# EAGLE board Papilio_DUO (EAGLE 6.6.0)
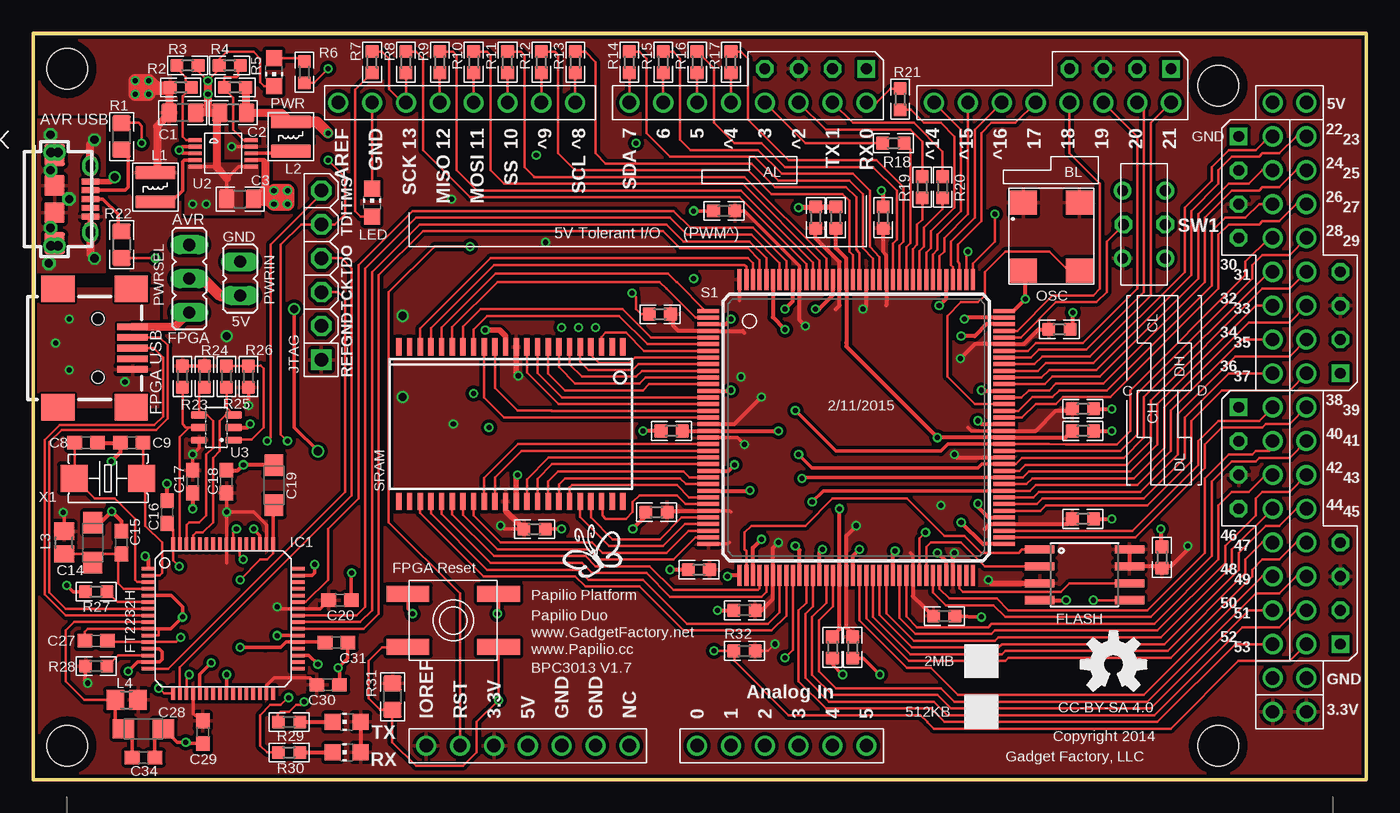
[diagram p5: board, top side]
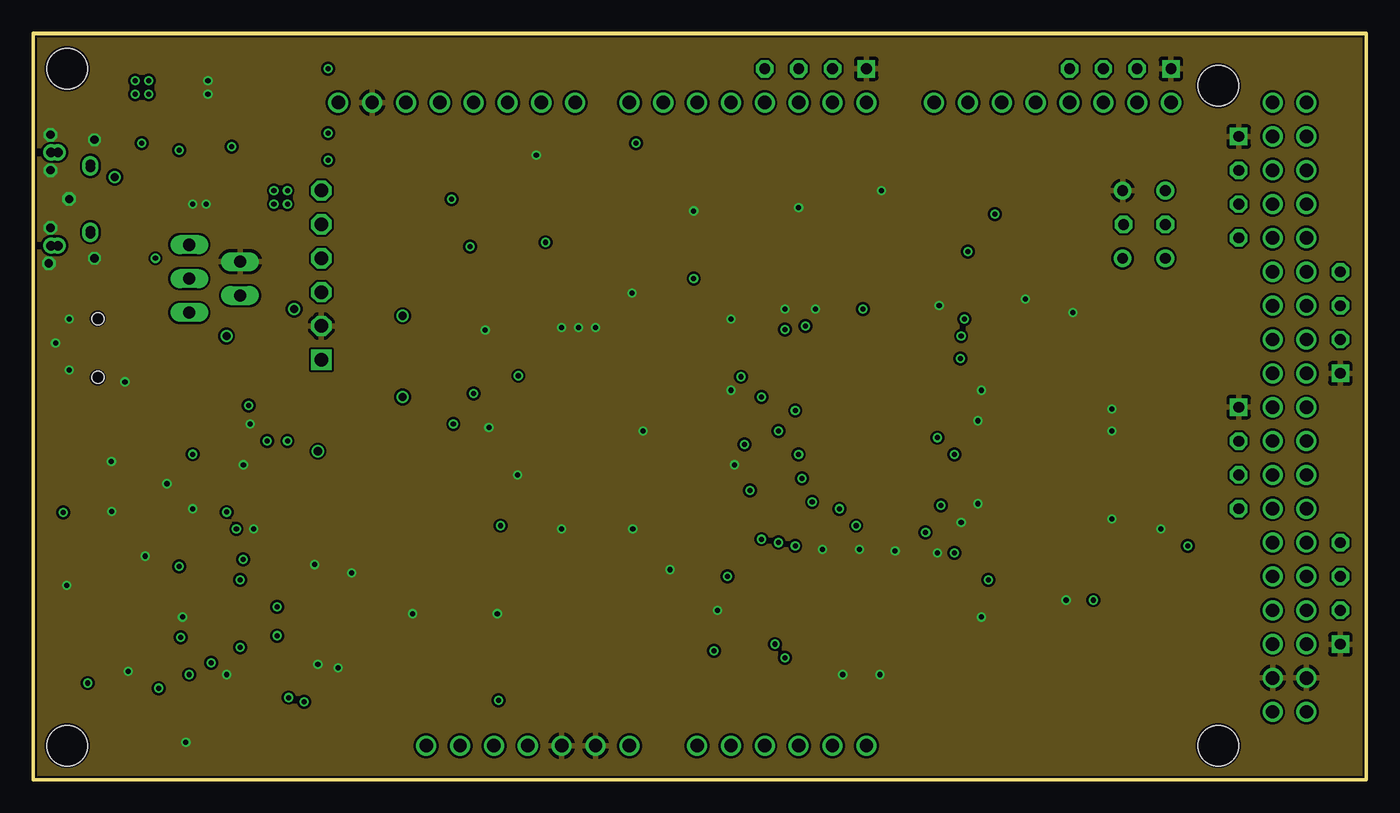
[diagram p6: board, inner layer Route2]
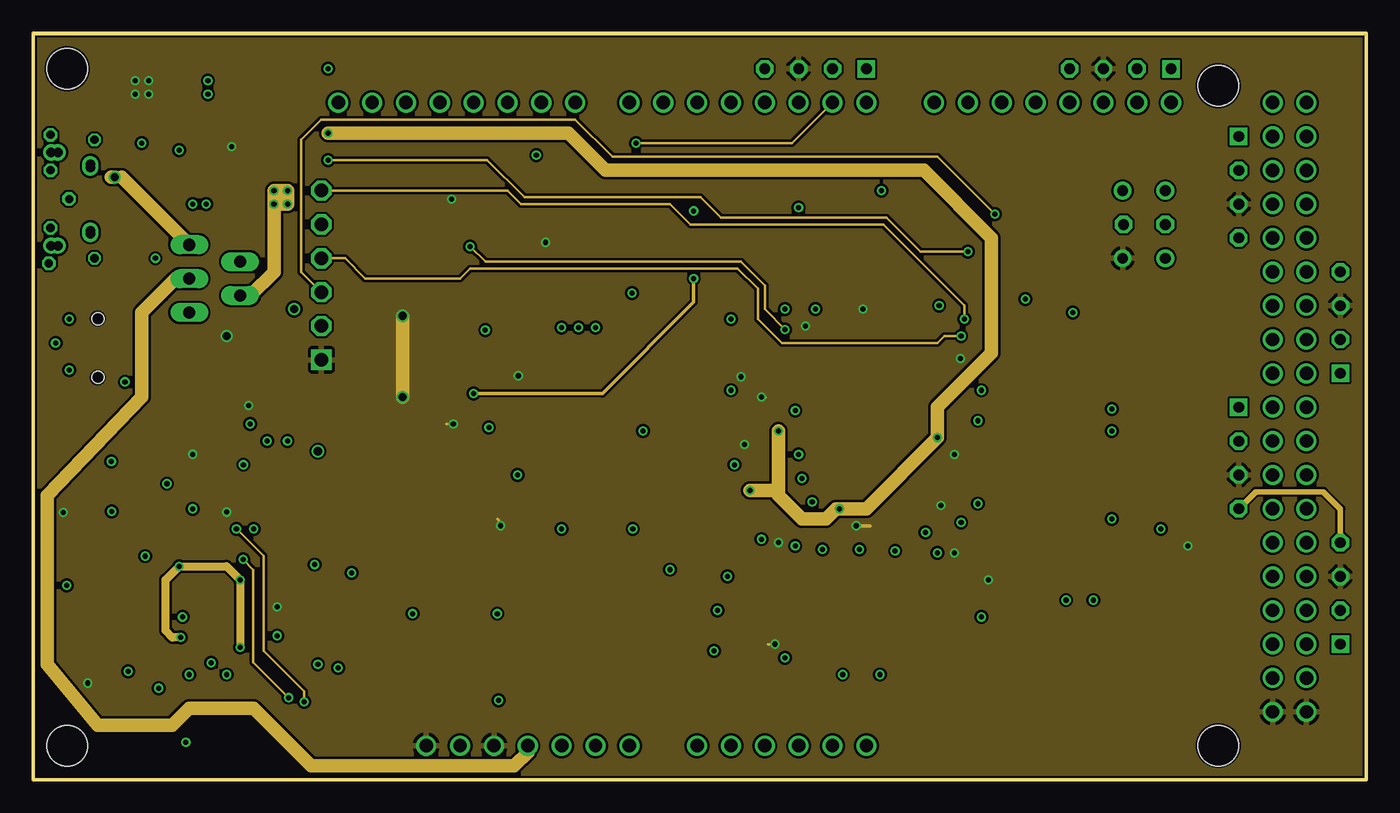
[diagram p7: board, inner layer Route3]
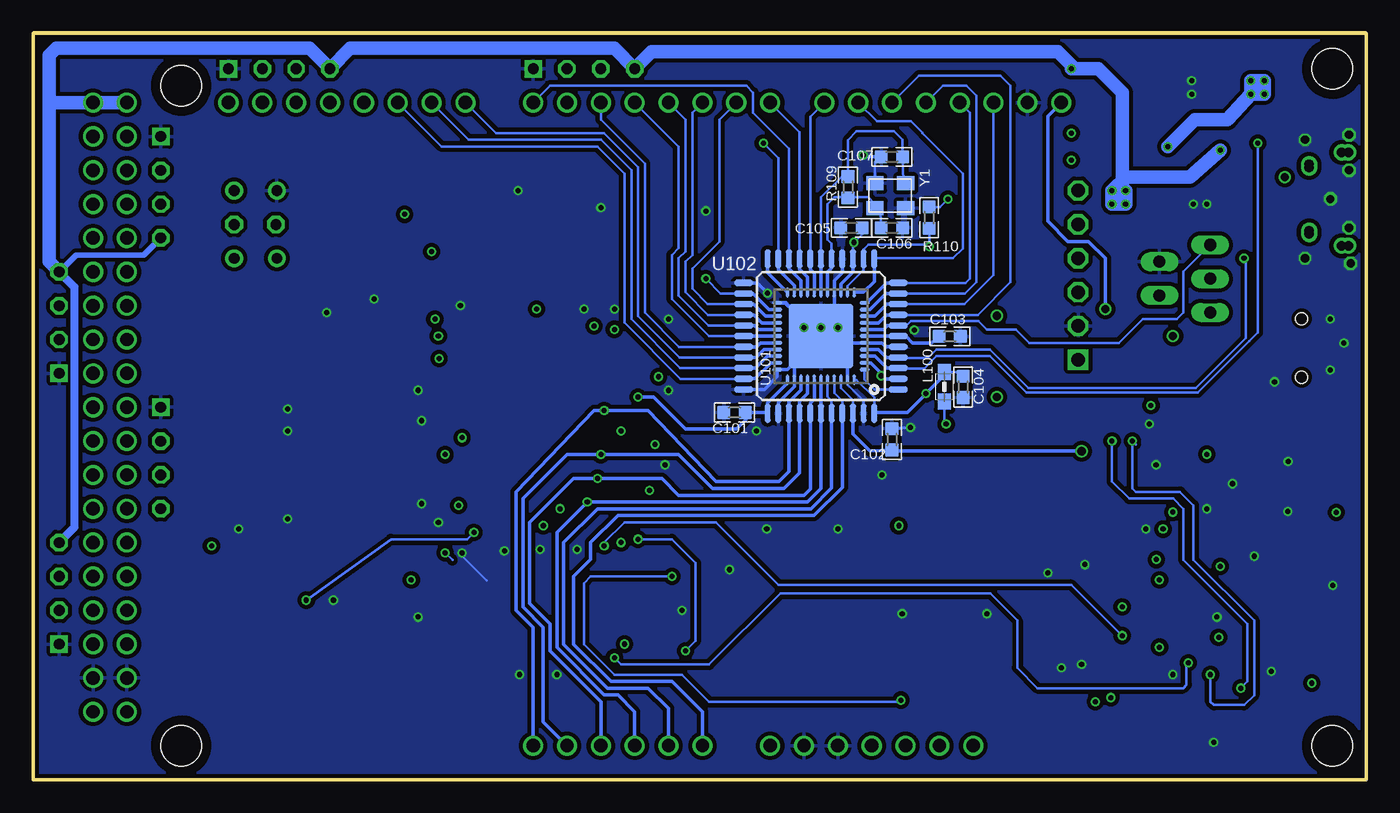
[diagram p8: board, bottom side, seen from below]

Size 100 x 56 mm. Coordinates in mm from the lower left corner, seen from the top.
Outline: 0,56 100,56 100,0 0,0 0,56
Outline: 0,56 56,56
Copper layers (1*2+3*16): Top 0.035mm / dielectric 1.5mm / Route2 0.035mm / dielectric 0.15mm / Route3 0.035mm / dielectric 0.2mm / Bottom 0.035mm
Design rules "hackvana *": minimum track width 6mil, minimum drill 0.3mm, track to track 6mil, track to pad 6mil, pad to pad 6mil, via to via 6mil, smd to smd 0mil, copper to edge 6mil, drill to drill 6mil, minimum pad ring 10mil, minimum via ring 6mil, stop-mask expansion 2mil, vias tented up to drill 100mil, thermal gap 10mil
Net classes: 0 default: width 0.178 mm, drill 0.381 mm, clearance 0.178 mm; 1 Power: width 0.254 mm, drill 0.381 mm, clearance 0.178 mm; 2 gnd: width 0.254 mm, drill 0.61 mm, clearance 0.254 mm; 3 usbvcc: width 0.254 mm, drill 0.61 mm, clearance 0.254 mm; 4 aref: width 0.254 mm, drill 0.61 mm, clearance 0.254 mm

## Footprints (pad centres in the part's own frame; a part is rotated, then mirrored left to right if it is on the bottom)
CON2_USB_MICRO_B_AT = drill 0.7 pad 0.813: K -3.505,0.254; L -3.505,-0.254; M 3.505,0.254; N 3.505,-0.254; O 2.616,2.692; P 2.362,2.692; Q -2.362,2.692; R -2.616,2.692 | smd 0.406 x 1.346: P1 -1.321,2.692; P2 -0.66,2.692; P3 0,2.692; P4 0.66,2.692; P5 1.321,2.692 | smd 1.651 x 1.549: S1 -3.302,0; S2 3.302,0 | smd 1.524 x 1.016: S3 -2.489,2.692; S4 2.489,2.692 | smd 1.524 x 1.524: S5 -1.016,0; S6 1.016,0
0805 = smd 1.2 x 1.4: 1 -1,0; 2 1,0
0603 = smd 1 x 1: 1 -0.8,0; 2 0.8,0
C603 = smd 1.1 x 1: 1 -0.85,0; 2 0.85,0
SMC_A = smd 1.6 x 1.4: + -1.5,0; - 1.5,0
SO08-EIAJ = smd 0.61 x 2.21: 1 -1.905,-3.378; 2 -0.635,-3.378; 3 0.635,-3.378; 4 1.905,-3.378; 5 1.905,3.353; 6 0.635,3.353; 7 -0.635,3.353; 8 -1.905,3.353
CONN_USB_MINI-B = smd 2 x 2.5: BODY@1 -4.45,2.5; BODY@2 4.45,2.5; BODY@3 4.45,-3; BODY@4 -4.45,-3 | smd 0.5 x 2.3: D+ 0,2.6; D- -0.8,2.6; GND 1.6,2.6; ID 0.8,2.6; VUSB -1.6,2.6 | hole 0.9: -2.2,0; 2.2,0
LQFP64 = smd 1 x 0.27: 1 -5.6,3.75; 2 -5.6,3.25; 3 -5.6,2.75; 4 -5.6,2.25; 5 -5.6,1.75; 6 -5.6,1.25; 7 -5.6,0.75; 8 -5.6,0.25; 9 -5.6,-0.25; 10 -5.6,-0.75; 11 -5.6,-1.25; 12 -5.6,-1.75; 13 -5.6,-2.25; 14 -5.6,-2.75; 15 -5.6,-3.25; 16 -5.6,-3.75; 33 5.6,-3.75; 34 5.6,-3.25; 35 5.6,-2.75; 36 5.6,-2.25; 37 5.6,-1.75; 38 5.6,-1.25; 39 5.6,-0.75; 40 5.6,-0.25; 41 5.6,0.25; 42 5.6,0.75; 43 5.6,1.25; 44 5.6,1.75; 45 5.6,2.25; 46 5.6,2.75; 47 5.6,3.25; 48 5.6,3.75 | smd 0.27 x 1: 17 -3.75,-5.6; 18 -3.25,-5.6; 19 -2.75,-5.6; 20 -2.25,-5.6; 21 -1.75,-5.6; 22 -1.25,-5.6; 23 -0.75,-5.6; 24 -0.25,-5.6; 25 0.25,-5.6; 26 0.75,-5.6; 27 1.25,-5.6; 28 1.75,-5.6; 29 2.25,-5.6; 30 2.75,-5.6; 31 3.25,-5.6; 32 3.75,-5.6; 49 3.75,5.6; 50 3.25,5.6; 51 2.75,5.6; 52 2.25,5.6; 53 1.75,5.6; 54 1.25,5.6; 55 0.75,5.6; 56 0.25,5.6; 57 -0.25,5.6; 58 -0.75,5.6; 59 -1.25,5.6; 60 -1.75,5.6; 61 -2.25,5.6; 62 -2.75,5.6; 63 -3.25,5.6; 64 -3.75,5.6
VLS3015 = smd 3 x 1: 1 0,1.1; 2 0,-1.1
FB603 = smd 1.3 x 1.5: 1 -0.85,0; 2 0.85,0
0805' = smd 1.2 x 1: 1 -1.1,0; 2 1.1,0
CHIP-LED0805 = smd 1.2 x 1.2: A 0,-1.05; C 0,1.05
OSC1 = smd 1.8 x 2: 1@1 0,0; 2@2 5.08,0; 3@3 5.08,4.2; 4@4 0,4.2
JP1 = drill 0.914 long: 1 0,-1.27; 2 0,1.27
JP2 = drill 0.914 long: 1 -2.54,0; 2 0,0; 3 2.54,0
TQ144 = smd 1.6 x 0.3: 1 -11.1,8.75; 2 -11.1,8.25; 3 -11.1,7.75; 4 -11.1,7.25; 5 -11.1,6.75; 6 -11.1,6.25; 7 -11.1,5.75; 8 -11.1,5.25; 9 -11.1,4.75; 10 -11.1,4.25; 11 -11.1,3.75; 12 -11.1,3.25; 13 -11.1,2.75; 14 -11.1,2.25; 15 -11.1,1.75; 16 -11.1,1.25; 17 -11.1,0.75; 18 -11.1,0.25; 19 -11.1,-0.25; 20 -11.1,-0.75; 21 -11.1,-1.25; 22 -11.1,-1.75; 23 -11.1,-2.25; 24 -11.1,-2.75; 25 -11.1,-3.25; 26 -11.1,-3.75; 27 -11.1,-4.25; 28 -11.1,-4.75; 29 -11.1,-5.25; 30 -11.1,-5.75; 31 -11.1,-6.25; 32 -11.1,-6.75; 33 -11.1,-7.25; 34 -11.1,-7.75; 35 -11.1,-8.25; 36 -11.1,-8.75; 73 11.1,-8.75; 74 11.1,-8.25; 75 11.1,-7.75; 76 11.1,-7.25; 77 11.1,-6.75; 78 11.1,-6.25; 79 11.1,-5.75; 80 11.1,-5.25; 81 11.1,-4.75; 82 11.1,-4.25; 83 11.1,-3.75; 84 11.1,-3.25; 85 11.1,-2.75; 86 11.1,-2.25; 87 11.1,-1.75; 88 11.1,-1.25; 89 11.1,-0.75; 90 11.1,-0.25; 91 11.1,0.25; 92 11.1,0.75; 93 11.1,1.25; 94 11.1,1.75; 95 11.1,2.25; 96 11.1,2.75; 97 11.1,3.25; 98 11.1,3.75; 99 11.1,4.25; 100 11.1,4.75; 101 11.1,5.25; 102 11.1,5.75; 103 11.1,6.25; 104 11.1,6.75; 105 11.1,7.25; 106 11.1,7.75; 107 11.1,8.25; 108 11.1,8.75 | smd 0.3 x 1.6: 37 -8.75,-11.1; 38 -8.25,-11.1; 39 -7.75,-11.1; 40 -7.25,-11.1; 41 -6.75,-11.1; 42 -6.25,-11.1; 43 -5.75,-11.1; 44 -5.25,-11.1; 45 -4.75,-11.1; 46 -4.25,-11.1; 47 -3.75,-11.1; 48 -3.25,-11.1; 49 -2.75,-11.1; 50 -2.25,-11.1; 51 -1.75,-11.1; 52 -1.25,-11.1; 53 -0.75,-11.1; 54 -0.25,-11.1; 55 0.25,-11.1; 56 0.75,-11.1; 57 1.25,-11.1; 58 1.75,-11.1; 59 2.25,-11.1; 60 2.75,-11.1; 61 3.25,-11.1; 62 3.75,-11.1; 63 4.25,-11.1; 64 4.75,-11.1; 65 5.25,-11.1; 66 5.75,-11.1; 67 6.25,-11.1; 68 6.75,-11.1; 69 7.25,-11.1; 70 7.75,-11.1; 71 8.25,-11.1; 72 8.75,-11.1; 109 8.75,11.1; 110 8.25,11.1; 111 7.75,11.1; 112 7.25,11.1; 113 6.75,11.1; 114 6.25,11.1; 115 5.75,11.1; 116 5.25,11.1; 117 4.75,11.1; 118 4.25,11.1; 119 3.75,11.1; 120 3.25,11.1; 121 2.75,11.1; 122 2.25,11.1; 123 1.75,11.1; 124 1.25,11.1; 125 0.75,11.1; 126 0.25,11.1; 127 -0.25,11.1; 128 -0.75,11.1; 129 -1.25,11.1; 130 -1.75,11.1; 131 -2.25,11.1; 132 -2.75,11.1; 133 -3.25,11.1; 134 -3.75,11.1; 135 -4.25,11.1; 136 -4.75,11.1; 137 -5.25,11.1; 138 -5.75,11.1; 139 -6.25,11.1; 140 -6.75,11.1; 141 -7.25,11.1; 142 -7.75,11.1; 143 -8.25,11.1; 144 -8.75,11.1
TSOP44-II = smd 0.4 x 1.3: 1 -8.4,-5.8; 2 -7.6,-5.8; 3 -6.8,-5.8; 4 -6,-5.8; 5 -5.2,-5.8; 6 -4.4,-5.8; 7 -3.6,-5.8; 8 -2.8,-5.8; 9 -2,-5.8; 10 -1.2,-5.8; 11 -0.4,-5.8; 12 0.4,-5.8; 13 1.2,-5.8; 14 2,-5.8; 15 2.8,-5.8; 16 3.6,-5.8; 17 4.4,-5.8; 18 5.2,-5.8; 19 6,-5.8; 20 6.8,-5.8; 21 7.6,-5.8; 22 8.4,-5.8; 23 8.4,5.8; 24 7.6,5.8; 25 6.8,5.8; 26 6,5.8; 27 5.2,5.8; 28 4.4,5.8; 29 3.6,5.8; 30 2.8,5.8; 31 2,5.8; 32 1.2,5.8; 33 0.4,5.8; 34 -0.4,5.8; 35 -1.2,5.8; 36 -2,5.8; 37 -2.8,5.8; 38 -3.6,5.8; 39 -4.4,5.8; 40 -5.2,5.8; 41 -6,5.8; 42 -6.8,5.8; 43 -7.6,5.8; 44 -8.4,5.8
6P-2CH-2.54-9.1X3.5X3.2+2H = drill 0.813 pad 1.27: CH1A -2.54,-1.6; CH1B 2.54,-1.6; CH2A -2.54,1.6; CH2B 2.54,1.6 | drill 0.813 pad 1.27 octagon: COM1 0,-1.6; COM2 0,1.524
EVQ-Q2 = smd 3.2 x 1.2: A -3.4,-2; A' 3.4,-2; B -3.4,2; B' 3.4,2
ARDUINO_MEGA_SHIELD = drill 1 pad 1.422: 3.3V 50.8,26.67; 3V3@1 48.26,85.09; 3V3@2 48.26,87.63; 5V@0 50.8,29.21; 5V@1 2.54,85.09; 5V@2 2.54,87.63; A0 50.8,41.91; A1 50.8,44.45; A2 50.8,46.99; A3 50.8,49.53; A4 50.8,52.07; A5 50.8,54.61; AREF 2.54,14.986; D2 2.54,49.53; D3 2.54,46.99; D4 2.54,44.45; D5 2.54,41.91; D6 2.54,39.37; D7 2.54,36.83; D8 2.54,32.766; D9 2.54,30.226; D10 2.54,27.686; D11 2.54,25.146; D12 2.54,22.606; D13 2.54,20.066; D14 2.54,59.69; D15 2.54,62.23; D16 2.54,64.77; D17 2.54,67.31; D18 2.54,69.85; D19 2.54,72.39; D20 2.54,74.93; D21 2.54,77.47; D22 5.08,85.09; D23 5.08,87.63; D24 7.62,85.09; D25 7.62,87.63; D26 10.16,85.09; D27 10.16,87.63; D28 12.7,85.09; D29 12.7,87.63; D30 15.24,85.09; D31 15.24,87.63; D32 17.78,85.09; D33 17.78,87.63; D34 20.32,85.09; D35 20.32,87.63; D36 22.86,85.09; D37 22.86,87.63; D38 25.4,85.09; D39 25.4,87.63; D40 27.94,85.09; D41 27.94,87.63; D42 30.48,85.09; D43 30.48,87.63; D44 33.02,85.09; D45 33.02,87.63; D46 35.56,85.09; D47 35.56,87.63; D48 38.1,85.09; D49 38.1,87.63; D50 40.64,85.09; D51 40.64,87.63; D52 43.18,85.09; D53 43.18,87.63; GND@0 50.8,31.75; GND@1 50.8,34.29; GND@2 2.54,17.526; GND@3 45.72,85.09; GND@4 45.72,87.63; IOREF 50.8,21.59; RES 50.8,24.13; RX 2.54,54.61; TX 2.54,52.07; VIN 50.8,36.83
MSOP10 = smd 0.28 x 1: 1 -1,-2.1; 2 -0.5,-2.1; 3 0,-2.1; 4 0.5,-2.1; 5 1,-2.1; 6 1,2.1; 7 0.5,2.1; 8 0,2.1; 9 -0.5,2.1; 10 -1,2.1
SOT23-6 = smd 0.55 x 1.2: 1 -0.95,-1.3; 2 0,-1.3; 3 0.95,-1.3; 4 0.95,1.3; 5 0,1.3; 6 -0.95,1.3
QFN44ML7X7 = smd 0.75 x 0.275: 1 -3.275,2.5; 2 -3.275,2; 3 -3.275,1.5; 4 -3.275,1; 5 -3.275,0.5; 6 -3.275,0; 7 -3.275,-0.5; 8 -3.275,-1; 9 -3.275,-1.5; 10 -3.275,-2; 11 -3.275,-2.5; 23 3.275,-2.5; 24 3.275,-2; 25 3.275,-1.5; 26 3.275,-1; 27 3.275,-0.5; 28 3.275,0; 29 3.275,0.5; 30 3.275,1; 31 3.275,1.5; 32 3.275,2; 33 3.275,2.5 | smd 0.275 x 0.75: 12 -2.5,-3.275; 13 -2,-3.275; 14 -1.5,-3.275; 15 -1,-3.275; 16 -0.5,-3.275; 17 0,-3.275; 18 0.5,-3.275; 19 1,-3.275; 20 1.5,-3.275; 21 2,-3.275; 22 2.5,-3.275; 34 2.5,3.275; 35 2,3.275; 36 1.5,3.275; 37 1,3.275; 38 0.5,3.275; 39 0,3.275; 40 -0.5,3.275; 41 -1,3.275; 42 -1.5,3.275; 43 -2,3.275; 44 -2.5,3.275 | smd 4.826 x 4.826: EXP 0,0
TQFP44-PAD = smd 1.4 x 0.45: 1 -5.8,4; 2 -5.8,3.2; 3 -5.8,2.4; 4 -5.8,1.6; 5 -5.8,0.8; 6 -5.8,0; 7 -5.8,-0.8; 8 -5.8,-1.6; 9 -5.8,-2.4; 10 -5.8,-3.2; 11 -5.8,-4; 23 5.8,-4; 24 5.8,-3.2; 25 5.8,-2.4; 26 5.8,-1.6; 27 5.8,-0.8; 28 5.8,0; 29 5.8,0.8; 30 5.8,1.6; 31 5.8,2.4; 32 5.8,3.2; 33 5.8,4 | smd 0.45 x 1.4: 12 -4,-5.8; 13 -3.2,-5.8; 14 -2.4,-5.8; 15 -1.6,-5.8; 16 -0.8,-5.8; 17 0,-5.8; 18 0.8,-5.8; 19 1.6,-5.8; 20 2.4,-5.8; 21 3.2,-5.8; 22 4,-5.8; 34 4,5.8; 35 3.2,5.8; 36 2.4,5.8; 37 1.6,5.8; 38 0.8,5.8; 39 0,5.8; 40 -0.8,5.8; 41 -1.6,5.8; 42 -2.4,5.8; 43 -3.2,5.8; 44 -4,5.8 | smd 1 x 1: P$1 0,0
JTAG = drill 1.016 octagon: JTAG_GND 10.16,0; JTAG_TCK 7.62,0; JTAG_TDI 2.54,0; JTAG_TDO 5.08,0; JTAG_TMS 0,0 | drill 1.016 square: JTAG_REF 12.7,0
STAND-OFF-TIGHT = hole 3.048: 0,0
POWER_NO_TEXT = drill 0.8 square: P1 0,3.81 | drill 0.8 octagon: P2 0,1.27; P3 0,-1.27; P4 0,-3.81
4X6 = smd 2.032 x 2.032: 1 -2.54,0; 2 2.54,0
CRYSTAL-3.2-2.5 = smd 1.3 x 1.05: 1 -1.15,-0.925; 2 1.15,-0.925; 3 1.15,0.925; 4 -1.15,0.925

## Placement (x,y rotation side)
AVRUSB  USB MICRO  [CON2_USB_MICRO_B_AT]  1.59,43.56 270 top
C1  22u/6V3  [0805]  11.19,50.04 180 top
C2  22u/6V3  [0805]  15,50.04 0 top
C3  10u/10V  [0805]  15.51,43.56 0 top
C4  .1uF  [0603]  47.01,34.92 180 top
C5  .1uF  [0603]  51.83,42.67 180 top
C6  .1uF  [0603]  58.69,42.16 90 top
C7  .1uF  [0603]  60.21,42.16 90 top
C8  27pF  [C603]  3.95,25.27 0 top
C9  27pF  [C603]  7.38,25.27 180 top
C10  .1uF  [0603]  47.9,26.16 180 top
C11  .1uF  [0603]  76.98,33.78 0 top
C12  .1uF  [0603]  78.76,27.81 0 top
C13  .1uF  [0603]  78.76,26.16 0 top
C14  4.7uF  [SMC_A]  4.46,17.78 90 top
C15  0.1uF  [C603]  6.62,17.78 90 top
C16  0.1uF  [C603]  10.05,20.07 90 top
C17  0.1uF  [C603]  11.95,22.35 270 top
C18  0.1uF  [C603]  14.49,22.35 90 top
C19  3.3uF  [SMC_A]  18.05,22.1 90 top
C20  0.1uF  [C603]  23,13.46 0 top
C21  .1uF  [0603]  37.61,18.8 0 top
C22  .1uF  [0603]  46.75,20.07 180 top
C23  .1uF  [0603]  49.93,15.75 180 top
C24  .1uF  [0603]  53.36,12.7 180 top
C25  .1uF  [0603]  78.76,19.56 0 top
C26  .1uF  [0603]  84.67,16.66 90 top
C27  0.1uF  [C603]  4.71,10.41 180 top
C28  4.7uF  [SMC_A]  8.27,3.81 0 top
C29  0.1uF  [C603]  12.72,3.56 270 top
C30  0.1uF  [C603]  22.11,7.11 0 top
C31  0.1uF  [C603]  22.75,10.29 0 top
C32  .1uF  [0603]  59.96,9.91 270 top
C33  .1uF  [0603]  61.48,9.91 270 top
C34  0.1uF  [C603]  8.27,1.65 0 top
C35  .1uF  [0603]  63.77,42.16 90 top
C36  .1uF  [0603]  68.34,12.27 0 top
C101  100n  [0603]  47.4,27.55 180 bottom
C102  100n  [0603]  35.58,25.53 270 bottom
C103  1uF  [0603]  31.24,33.26 0 bottom
C104  1uF  [0603]  30.24,29.46 270 bottom
C105  100n  [0603]  38.62,41.4 180 bottom
C106  22p  [0603]  35.58,41.4 180 bottom
C107  22p  [0603]  35.58,46.74 180 bottom
FLASH  FLASH-SPI-25XXSMD1  [SO08-EIAJ]  78.88,15.37 270 top
FPGAUSB  CONN_USB  [CONN_USB_MINI-B]  4.84,32.38 270 top
IC1  FT2232H  [LQFP64]  14.24,12.06 0 top
L1  3.3uH  [VLS3015]  9.16,44.45 180 top
L2  3.3uH  [VLS3015]  19.32,48.26 180 top
L3  [FB603]  2.3,17.78 90 top
L4  [FB603]  7,5.97 0 top
L100  MH2029-300Y  [0805']  31.64,29.46 90 bottom
LED  Yellow  [CHIP-LED0805]  25.42,43.31 0 top
OSC  [OSC1]  74.29,43.28 270 top
PWR  Green  [CHIP-LED0805]  18.05,53.09 180 top
PWRIN  [JP1]  15.51,37.59 0 top
PWRSEL  [JP2]  11.7,37.59 90 top
R1  22R  [0805]  6.62,48.26 90 top
R2  6K8 1%  [0603]  11.06,51.94 180 top
R3  1K5 1%  [0603]  11.57,53.59 180 top
R4  1K5 1%  [0603]  14.75,53.59 0 top
R5  1K5 1%  [0603]  15.13,51.94 0 top
R6  1K8  [0603]  20.34,53.09 270 top
R7  4.7K  [0603]  25.42,53.85 90 top
R8  390  [0603]  27.96,53.85 270 top
R9  390  [0603]  30.5,53.85 270 top
R10  390  [0603]  33.04,53.85 270 top
R11  390  [0603]  35.58,53.85 270 top
R12  390  [0603]  38.12,53.85 270 top
R13  390  [0603]  40.66,53.85 270 top
R14  390  [0603]  44.72,53.85 270 top
R15  390  [0603]  47.26,53.85 270 top
R16  390  [0603]  49.8,53.85 270 top
R17  390  [0603]  52.34,53.85 270 top
R18  390  [0603]  64.53,47.75 180 top
R19  390  [0603]  66.69,44.45 90 top
R20  390  [0603]  68.22,44.45 90 top
R21  390  [0603]  65.04,51.05 90 top
R22  22R  [0805]  6.62,40.13 270 top
R23  10k  [0603]  11.19,30.23 90 top
R24  10k  [0603]  12.84,30.23 90 top
R25  2.2k  [0603]  14.49,30.23 270 top
R26  10k  [0603]  16.14,30.23 270 top
R27  12k 1%  [0603]  4.71,14.1 0 top
R28  10k  [0603]  4.71,8.51 0 top
R29  1K  [0603]  19.19,4.32 0 top
R30  1K  [0603]  19.19,2.03 0 top
R31  47K  [0805]  26.94,6.22 90 top
R32  4.7K  [0603]  53.36,9.65 0 top
R109  1M  [0603]  38.88,44.45 270 bottom
R110  10K  [0603]  32.78,42.16 90 bottom
RX  [CHIP-LED0805]  23.51,2.03 90 top
S1  6SLX9TQG144  [TQ144]  61.74,26.42 0 top
SRAM  [TSOP44-II]  35.83,26.67 180 top
SW1  SWITCH-2CH-6P-3010010P1  [6P-2CH-2.54-9.1X3.5X3.2+2H]  83.33,41.66 90 top
SW2  EVQQ2  [EVQ-Q2]  31.51,11.94 0 top
TX  [CHIP-LED0805]  23.51,4.32 90 top
U1  ARDUINO_MEGA_SHIELD  [ARDUINO_MEGA_SHIELD]  7.89,53.34 270 top
U2  LTC3419EMS  [MSOP10]  14.24,46.99 270 top
U3  93C56B  [SOT23-6]  13.73,26.42 90 top
U101  ATMEGA32U4-XUMU  [QFN44ML7X7]  40.91,33.27 180 bottom
U102  ATMEGA32U4-XUAU  [TQFP44-PAD]  40.91,33.27 180 bottom
U$1  JTAG_XILINX  [JTAG]  21.61,44.2 270 top
U$2  [STAND-OFF-TIGHT]  2.54,53.34 0 top
U$3  [STAND-OFF-TIGHT]  2.54,2.54 0 top
U$4  [STAND-OFF-TIGHT]  88.9,2.54 0 top
U$5  [STAND-OFF-TIGHT]  88.9,52.07 0 top
U$7  [GADGETFACTORY_LOGO]  39.51,14.61 0 top
U$9  [OSHW-LOGO-M]  81.04,8.64 0 top
WING_POWER1  HEADER_FEMALE_4  [POWER_NO_TEXT]  58.69,53.34 270 top
WING_POWER2  HEADER_FEMALE_4  [POWER_NO_TEXT]  98.06,13.97 180 top
WING_POWER3  HEADER_FEMALE_4  [POWER_NO_TEXT]  98.06,34.29 180 top
WING_POWER4  HEADER_FEMALE_4  [POWER_NO_TEXT]  81.55,53.34 270 top
WING_POWER5  HEADER_FEMALE_4  [POWER_NO_TEXT]  90.44,44.45 0 top
WING_POWER6  HEADER_FEMALE_4  [POWER_NO_TEXT]  90.44,24.13 0 top
X1  12MHz  [4X6]  5.6,22.61 180 top
Y1  16MHz KX-7  [CRYSTAL-3.2-2.5]  35.7,43.81 180 bottom

## Tracks (layer width: path | path; a pad name or v marks a point on that pad's centre or on a via)
1.8V  (via drill 0.38)
  Top 0.203: v11.06,10.67 10.71,10.31 IC1.12 5.66,10.31 C27.1 | v10.94,16 10.49,16.45 IC1.64 10.49,18.77 C16.1 | 21.87,10.31 C31.1 | IC1.49 17.99,16.96 17.54,16.51 17.03,16.51 v15.51,14.99
  Top 0.254: IC1.49 17.99,20.54 C19.+ | v15.51,9.93 17.41,9.91 18.56,9.91 18.97,10.31 IC1.37 21.87,10.31
  Route3 0.61: v11.06,10.67 10.43,10.67 9.92,11.18 9.92,14.99 v10.94,16 14.49,16 v15.51,14.99 v15.51,9.93
1V2  (via drill 0.38)
  Top 0.203: 60.99,39.1 60.98,39.12 | 60.49,20.3 v60.47,20.32 | v55.89,26.17 v55.9,26.16 | 53.74,21.67 v53.76,21.69 | 67.85,25.67 v67.83,25.65 | 60.99,32.78 60.98,32.77
  Top 0.254: S1.19
  Top 0.305: 60.98,39.12 60.21,39.88 C7.1 | C10.1 S1.19 | 60.99,39.1 S1.128 60.99,32.78 60.99,32.5 v67.83,25.65 | 60.49,20.3 S1.52 60.49,11.3 C32.1 | S1.19 v55.89,26.17 | S1.28 53.74,21.67 | C13.1 77.44,25.67 S1.89 67.85,25.67
  Top 0.61: L2.2 18.64,50.04 C2.2 15.93,50.11 R5.2
  Top 0.813: L2.2 21.27,49.36 v22.11,48.51
  Route3 0.813: v60.47,20.32 60.21,20.32 | 55.9,21.34 55.9,21.59 55.79,21.69
  Route3 1.016: v22.11,48.51 40.15,48.51 42.94,45.72 66.82,45.72 71.9,40.64 71.9,32 67.83,27.94 v67.83,25.65 62.5,20.32 v60.47,20.32 | 60.21,20.32 59.45,19.56 57.67,19.56 55.9,21.34 | v55.9,26.16 55.9,21.59 | v53.76,21.69 55.79,21.69
3V3  (via drill 0.38, 0.6, 0.61)
  Top 0.203: C22.1 47.65,20.17 | 64.02,35.56 63.99,35.6 | 78.09,27.69 C12.1 77.83,27.69 | FLASH.8 82.22,16.02 | 35.94,19.67 35.92,19.67 | 35.45,20.85 SRAM.33 | 48.02,34.71 C4.1 | R32.2 55.13,9.65 v55.64,10.16 | 14.49,16.26 | 14.49,18.29 14.49,18.28 IC1.56 | v14.49,20.06 v14.49,20.07
  Top 0.254: S1.122 64.02,37.55 | S1.18 52.34,26.67 | S1.20 52.84,25.67 v53.36,25.15 | S1.31 52.24,20.17 52.34,20.07 | S1.63 65.99,16.83 65.8,17.02 | S1.90 70.37,26.17 70.12,26.42 | C5.1 53.36,42.67 57.49,38.54 S1.135 | U2.9 v14.88,47.5 | v18.3,12.95 18.44,12.81 IC1.42 21.51,12.81 C20.1 | R26.2 v16.14,28.07 | IC1.31 17.49,7.06 18.05,7.62 20.76,7.62 C30.1 | R28.1 3.87,7.45 v4.08,7.24 | L3.2 2.3,19.99 v2.25,20.04 | C18.1 v14.49,20.07 16.53,20.07 17.49,19.1 IC1.50 | U3.6 12.43,24.89 v11.95,24.41 C17.1 | IC1.20 11.99,4.95 C29.1 | C21.1 35.32,18.8 v35.07,19.05 | 14.49,16.26 IC1.56 | 14.49,18.28 v14.49,20.06 | R23.2 R24.2 | S1.144 52.99,35.95 52.98,35.94 | S1.36 52.1,17.67 52.21,17.78
  Top 0.305: 53.36,33.53 53.22,33.67 S1.4 48.39,33.67 48.02,34.04 48.02,34.71 | 71.39,18.8 71.76,19.17 S1.76 77.59,19.17 C25.1 | C6.1 58.69,40.64 60.49,38.84 S1.129 60.49,35.58 60.21,35.31 | 47.65,20.17 S1.31 | C24.1 54.63,12.7 55.49,13.56 S1.42 55.49,17.37 v55.9,17.78 | S1.86 69.32,24.17 v69.1,24.38 | FLASH.8 FLASH.7 | S1.90 75.2,26.17 76.72,27.69 77.83,27.69 | C33.1 61.48,10.92 60.99,11.42 S1.53 60.99,18.3 v61.74,19.05 | S1.69 68.99,16.9 v69.1,17.02 | S1.135 57.49,34.48 v57.93,34.04 | S1.125 62.49,35.55 v62.25,35.31 | TX.A RX.A | v69.56,31.6 70.63,32.67 S1.103 74.3,32.67 75.42,33.78 C11.1 | S1.18 52.59,26.67 v54.63,28.7 | C35.1 63.77,39.62 63.99,39.33 S1.122 63.99,35.6 | S1.63 65.99,13.75 C36.1 | 82.22,16.02 84.52,16.02 C26.1 84.81,16 85.36,16 86.63,17.27 v86.63,17.53
  Top 0.406: C21.1 35.94,19.67 | v71.64,14.99 71.9,14.73 FLASH.3 | 35.92,19.67 35.45,20.14 35.45,20.85 | SRAM.11 36.23,30.46 v36.39,30.3
  Top 0.61: R2.2 10.19,51.87 C1.2 9.29,49.02 9.29,45.68 L1.2
  Top 1.016: 10.19,51.87 9.23,51.87 v8.65,52.45 v7.64,52.45 v7.64,51.44 v8.65,51.44
  Route3 0.178: v31.51,26.67 31,26.67
  Route3 0.203: v35.07,19.05 35.07,19.3 34.81,19.56 | v55.64,10.16 55.13,10.16 | v55.9,17.78 56.15,17.78
  Route3 0.254: v61.74,19.05 62.75,19.05
  Route3 0.305: v54.63,28.7 54.88,28.7
  Route3 1.016: v27.7,28.7 v27.7,34.8
  Bottom 0.178: L100.1 31.64,26.8 v31.51,26.67
  Bottom 0.203: 68.56,16.47 v69.1,17.02 | R110.2 31.98,42.96 v31.39,43.56 | U102.14 38.51,40.22 v38.42,40.31 37.75,40.98 C105.1
  Bottom 0.254: U101.14 39.41,37.17 38.51,38.07 U102.14 | U101.34 43.41,29.74 44.91,28.24 U102.34 44.99,27.55 C101.1 46.52,27.01 47.24,26.29 51.05,26.29 53.47,28.7 v54.63,28.7 | U101.2 37.14,31.27 36.39,30.52 v36.39,30.3 36.16,30.07 U102.2
  Bottom 1.016: v8.65,51.44 v7.64,51.44 v7.64,52.45 v8.65,52.45 v8.65,51.44 | v14.88,47.5 12.84,49.53 10.43,49.53 v8.65,51.44
  other vias: 53.1,30.23 68.09,20.57 14.49,33.27
  pour Top (isolate 0.254, rank 3): 0,56 0,0 100,0 100,56
  pour Route3: 0,56 100,56 100,0 0,0
5V0  (via drill 0.38)
  Top 0.203: R6.2 21.06,52.29 v22.11,53.34
  Top 0.254: U2.3 11.19,46.99 v10.94,47.24 11.18,47.49 U2.2
  Top 0.305: U2.7 17.29,46.48 17.41,46.36 17.41,46.23
  Top 0.61: 17.41,46.23 17.41,44.34 C3.2
  Top 0.813: 18.05,43.69 18.56,44.2 | PWRSEL.2 12.72,37.59 13.99,36.32 PWRIN.1
  Top 1.016: C3.2 17.67,43.56 v18.05,43.18 | v18.05,43.18 v18.05,44.2 18.56,44.2 v19.07,44.2 v19.07,43.18 18.81,43.18 | 18.81,43.18 v18.05,43.18 | 18.68,43.56 18.81,43.18
  Route3 0.406: WING_POWER2.P4 98.06,20.32 96.79,21.59 91.71,21.59 WING_POWER6.P4
  Route3 1.016: PWRIN.1 16.27,36.32 18.05,38.1 v18.05,43.18 | U1.5V@0 37.1,2.03 36.08,1.02 20.84,1.02 16.53,5.33 11.7,5.33 10.43,4.06 4.84,4.06 1.03,8.64 1.03,21.34 8.14,28.7 8.14,35.05 10.68,37.59 PWRSEL.2 | v18.05,43.18 v18.05,44.2 v19.07,44.2 v19.07,43.18 v18.05,43.18
  Bottom 0.406: WING_POWER3.P4 96.79,39.37 91.71,39.37 WING_POWER5.P4
  Bottom 0.61: 18.3,44.45 v18.05,44.2 | WING_POWER3.P4 96.92,36.96 96.92,18.92 WING_POWER2.P4
  Bottom 0.813: v22.11,53.34 22.11,53.59
  Bottom 1.016: v19.07,44.2 18.05,45.21 13.22,45.21 v10.94,47.24 | v19.07,44.2 v19.07,43.18 v18.05,43.18 v18.05,44.2 v19.07,44.2 | v22.11,53.34 20.08,53.34 18.3,51.56 18.3,44.45 | U1.5V@1 U1.5V@2 98.82,50.8 | 22.11,53.59 23.13,54.61 53.61,54.61 WING_POWER1.P4 56.4,54.86 76.22,54.86 WING_POWER4.P4 79.26,54.86 98.3,54.86 98.82,54.34 98.82,50.8 | 98.82,50.8 98.82,38.86 WING_POWER3.P4
5V_ARDUINO  (via drill 0.61)
  Top 0.406: AVRUSB.P1 5.78,44.88 v6.11,45.21
  Route3 0.61: v6.11,45.21 6.62,45.21
  Route3 1.016: 5.86,45.21 v6.11,45.21 | 6.62,45.21 PWRSEL.3
  Bottom 0.203: PWRSEL.3 13.72,38.12 13.72,35.05 14.22,34.54 16.76,34.54 18.54,32.77 25.27,32.77 26.29,33.78 28.45,33.78 29.08,34.42 34.16,34.42 34.54,34.04 35.07,34.04 U102.7
  Bottom 0.254: U101.7 36.2,33.77 35.9,34.07 U102.7
5V_FT2232
  Top 0.61: FPGAUSB.VUSB 10.63,33.98 PWRSEL.1
!CS
  Top 0.203: S1.12 46.19,29.67 45.74,29.21 39.89,29.21 38.63,30.47 SRAM.8
!OE
  Top 0.203: S1.26 49.23,22.67 48.78,23.11 39.39,23.11 38.63,22.36 SRAM.37
!RESET
  Top 0.203: IC1.14 6.37,9.31 R28.2
!WE
  Top 0.203: S1.6 46.09,32.67 43.96,34.8 34.05,34.8 33.03,33.78 SRAM.15
A0
  Top 0.203: S1.7 45.83,32.17 44.47,33.53 42.94,33.53 42.63,33.22 SRAM.3
A1
  Top 0.203: S1.8 45.14,31.67 44.72,31.24 42.43,31.24 41.83,31.85 SRAM.4
A2
  Top 0.203: S1.9 45.41,31.17 44.97,30.73 41.67,30.73 41.03,31.38 SRAM.5
A3
  Top 0.203: S1.10 45.67,30.67 45.23,30.23 41.16,30.23 40.23,31.16 SRAM.6
A4
  Top 0.203: S1.11 45.93,30.17 45.48,29.72 40.66,29.72 39.43,30.94 SRAM.7
A5
  Top 0.203: S1.5 46.35,33.17 44.21,35.31 33.54,35.31 32.23,33.99 SRAM.16
A6
  Top 0.203: SRAM.17 31.43,33.95 34.81,37.34 46.99,37.34 47.5,36.83 47.51,36.83 49.68,34.67 S1.2
A7
  Top 0.203: S1.1 50.45,35.17 48.28,37.34 48.26,37.34 47.62,37.97 34.69,37.97 30.63,33.92 SRAM.18
A8
  Top 0.203: SRAM.19 29.83,33.88 34.56,38.61 53.36,38.61 53.49,38.48 S1.143
A9
  Top 0.203: S1.142 53.99,38.74 53.61,39.12 34.31,39.12 29.03,33.84 SRAM.20
A10
  Top 0.203: S1.43 55.99,12.54 55.13,11.68 49.04,11.68 45.74,14.99 41.67,14.99 40.91,15.75 34.05,15.75 29.83,19.97 SRAM.26
A11
  Top 0.203: S1.41 54.99,14.08 54.63,13.72 47.77,13.72 45.99,15.49 41.93,15.49 41.16,16.26 34.31,16.26 30.63,19.93 SRAM.27
A12
  Top 0.203: S1.40 54.49,14.34 54.37,14.22 48.02,14.22 46.24,16 42.18,16 41.42,16.76 34.56,16.76 31.43,19.89 SRAM.28
A13
  Top 0.203: S1.35 49.68,18.17 48.02,16.51 42.43,16.51 41.67,17.27 34.81,17.27 32.23,19.86 SRAM.29
A14
  Top 0.203: S1.34 49.16,18.67 47.51,17.02 42.69,17.02 41.93,17.78 35.07,17.78 33.03,19.82 SRAM.30
A15
  Top 0.203: S1.27 48.97,22.17 48.53,22.61 39.89,22.61 39.43,22.14 SRAM.38
A16
  Top 0.203: S1.29 49.21,21.17 48.28,22.1 40.4,22.1 40.23,21.93 SRAM.39
A17
  Top 0.203: S1.33 48.9,19.17 47.26,17.53 43.2,17.53 41.03,19.69 SRAM.40
A18
  Top 0.203: S1.32 48.64,19.67 47.01,18.03 43.45,18.03 41.83,19.65 SRAM.41
A19
  Top 0.203: S1.44 56.49,12.28 55.39,11.18 48.78,11.18 45.48,14.48 41.42,14.48 40.66,15.24 33.8,15.24 29.03,20.01 SRAM.25
A20
  Top 0.203: S1.30 48.95,20.67 48.28,21.34 45.48,21.34 44.97,20.83 44.97,20.07 44.47,19.56 42.94,19.56 42.69,19.81 42.69,20.81 SRAM.42
AD0-JTAG_TCK  (via drill 0.38)
  Top 0.203: IC1.16 10.11,8.31 23.38,21.59 23.38,36.07 22.88,36.58 U$1.JTAG_TCK | S1.109 70.49,38.72 72.15,40.39 v72.15,42.42
  Route3 0.203: v72.15,42.42 67.83,46.74 43.45,46.74 40.66,49.53 21.61,49.53 20.08,48.01 20.08,38.1 U$1.JTAG_TCK
AD1-JTAG_TDI  (via drill 0.38)
  Top 0.203: IC1.17 9.81,6.46 v9.41,6.86 | S1.110 69.99,39.5 v70.12,39.62 | v19.07,25.4 18.56,25.91 18.56,40.13 20.08,41.66 U$1.JTAG_TDI 22.62,41.66 23.38,42.42 23.38,45.21 v22.11,46.48
  Route3 0.203: v70.12,39.62 66.56,39.62 64.02,42.16 51.58,42.16 50.05,43.69 36.85,43.69 34.05,46.48 v22.11,46.48
  Bottom 0.203: v9.41,6.86 8.91,7.37 8.91,11.68 13.72,16.49 13.72,20.32 14.48,21.08 17.78,21.08 19.07,22.37 v19.07,25.4
AD2-JTAG_TDO  (via drill 0.38)
  Top 0.203: IC1.18 10.99,8.43 23.89,21.34 23.89,38.35 23.13,39.12 U$1.JTAG_TDO
  Top 0.305: S1.106 71.52,34.17 70.63,33.27 v69.61,33.27
  Route3 0.203: U$1.JTAG_TDO 23.38,39.12 24.91,37.59 32.02,37.59 32.78,38.35 52.85,38.35 54.37,36.83 54.37,34.54 56.15,32.77 67.83,32.77 68.34,33.27 v69.61,33.27
AD3-JTAG_TMS  (via drill 0.38)
  Top 0.203: v17.54,25.4 17.8,25.65 17.8,40.13 21.61,43.94 U$1.JTAG_TMS | IC1.19 11.49,7.68 v11.68,7.87
  Top 0.305: S1.107 69.99,34.67 v69.87,34.54
  Route3 0.203: v69.87,34.54 69.87,35.56 63.77,41.66 49.29,41.66 47.77,43.18 36.59,43.18 35.58,44.2 U$1.JTAG_TMS
  Bottom 0.203: 17.29,25.15 v17.54,25.4 17.54,21.86 17.27,21.59 13.97,21.59 12.95,20.57 12.95,16.49 8.4,11.94 8.4,6.33 9.14,5.59 11.43,5.59 11.68,5.84 v11.68,7.87
AD4-DTR  (via drill 0.38)
  Top 0.203: S1.45 56.99,9.73 v56.4,9.14
  Top 0.254: IC1.21 12.49,7.9 v13.35,8.76
  Bottom 0.203: v56.4,9.14 55.9,8.64 49.29,8.64 43.96,13.97 28.21,13.97 26.18,11.94 26.18,8.38 24.65,6.86 13.73,6.86 13.48,7.11 13.48,8.64 v13.35,8.76
ARD_RESET  (via drill 0.38)
  Top 0.203: U1.RES 32.02,13.95 26.67,19.3 26.67,36.58 30.1,40.01 v32.78,40.01
  Top 0.305: v56.4,33.78 55.49,34.7 S1.139
  Route3 0.203: v56.4,33.78 54.88,35.31 54.88,37.08 53.1,38.86 33.92,38.86 v32.78,40.01
  Bottom 0.203: R110.1 v32.78,40.01 32.91,40.13 37.34,40.13 37.71,39.76 U102.13 37.71,38.24 38.91,37.04 U101.13
AREF  (via drill 0.61)
  Top 0.254: v19.57,35.31 19.57,26.42 v21.35,24.64
  Bottom 0.203: U101.42 39.41,29.38 38.51,28.48 U102.42
  Bottom 0.254: v21.35,24.64 35.56,24.64 C102.2 37.23,24.65 38.51,25.94 U102.42 | U1.AREF 23.89,49.78 23.89,41.91 22.37,40.39 20.84,40.39 19.57,39.12 v19.57,35.31
ATMEGA_A0
  Bottom 0.203: U101.41 39.91,28.99 39.31,28.39 U102.41
  Bottom 0.254: U1.A0 49.8,5.08 52.09,7.37 56.66,7.37 59.45,10.16 59.45,15.24 58.18,16.51 58.18,17.78 56.15,19.81 41.42,19.81 39.31,21.92 U102.41
ATMEGA_A1
  Bottom 0.203: U101.40 40.41,28.73 40.11,28.43 U102.40
  Bottom 0.254: U1.A1 52.34,5.33 53.86,6.86 56.91,6.86 60.21,10.16 60.21,17.78 57.67,20.32 41.67,20.32 40.11,21.88 U102.40
ATMEGA_D0/RX
  Top 0.203: R21.2 64.32,51.85 63.26,50.8 U1.RX
  Bottom 0.203: U1.RX 61.23,52.07 46.5,52.07 45.99,51.56 45.99,50.04 43.31,47.36 U102.20
  Bottom 0.254: U101.20 42.41,37.46 43.31,38.36 U102.20
ATMEGA_D1/TX  (via drill 0.38)
  Top 0.203: U1.TX 61.48,49.28 66.06,49.28 68.22,47.12 R20.2
  Route3 0.203: v45.23,47.75 56.91,47.75 U1.TX
  Bottom 0.203: U102.21 44.11,46.63 v45.23,47.75
  Bottom 0.254: U101.21 42.91,37.07 44.11,38.27 U102.21
ATMEGA_D2
  Top 0.203: U1.D2 59.45,48.77 65.8,48.77 66.69,47.88 R19.2
  Bottom 0.203: U1.D2 57.42,49.53 54.12,46.23 54.12,35.05 51.54,32.47 U102.29
  Bottom 0.254: U101.29 45.46,32.77 45.76,32.47 U102.29
ATMEGA_D3
  Top 0.203: U1.D3 57.93,47.75 R18.2
  Bottom 0.203: U1.D3 51.58,47.5 51.58,39.88 52.09,39.37 52.09,36.07 49.29,33.27 U102.28
  Bottom 0.254: U101.28 U102.28
ATMEGA_D4
  Top 0.203: U1.D4 R17.2
  Bottom 0.203: U1.D4 51.07,49.53 51.07,39.62 51.58,39.12 51.58,36.32 49.33,34.07 U102.27
  Bottom 0.254: U101.27 45.59,33.77 45.88,34.07 U102.27
ATMEGA_D5*
  Top 0.203: U1.D5 R16.2
  Bottom 0.203: U1.D5 50.56,50.04 50.56,39.37 51.07,38.86 51.07,36.58 49.37,34.87 U102.26
  Bottom 0.254: U101.26 45.32,34.27 45.92,34.87 U102.26
ATMEGA_D6*
  Top 0.203: U1.D6 R15.2
  Bottom 0.203: U1.D6 48.53,49.53 48.53,40.39 50.56,38.35 50.56,36.83 49.41,35.67 U102.25
  Bottom 0.254: U101.25 45.06,34.77 45.96,35.67 U102.25
ATMEGA_D7
  Top 0.203: U1.D7 R14.2
  Bottom 0.203: U102.19 42.51,48.59 U1.D7
  Bottom 0.254: U101.19 41.91,37.72 42.51,38.32 U102.19
ATMEGA_IO8
  Top 0.203: U1.D8 R13.2
  Bottom 0.203: U1.D8 41.71,49.75 U102.18
  Bottom 0.254: U101.18 41.41,37.98 41.71,38.28 U102.18
ATMEGA_IO9*
  Top 0.203: U1.D9 R12.2
  Bottom 0.203: U102.12 36.87,39.12 30.99,39.12 30.24,39.86 30.24,45.47 33.29,48.51 33.29,48.53 34.16,49.4 36.72,49.4 U1.D9
  Bottom 0.254: U102.12 36.91,37.38 37.72,36.58 38.38,36.58 U101.12
ATMEGA_IO10*
  Top 0.203: U1.D10 R11.2
  Bottom 0.203: U1.D10 33.54,52.83 27.45,52.83 26.69,52.07 26.69,37.34 29.15,34.87 U102.8
  Bottom 0.254: U101.8 36.59,34.27 35.99,34.87 U102.8
ATMEGA_IO11*
  Top 0.203: U1.D11 R10.2
  Bottom 0.203: U1.D11 31.77,52.07 29.99,52.07 29.23,51.31 29.23,37.34 30.09,36.47 U102.10
  Bottom 0.254: U101.10 37.24,35.27 36.04,36.47 U102.10
ATMEGA_IO12
  Top 0.203: U1.D12 R9.2
  Bottom 0.203: U1.D12 29.73,50.04 29.73,37.59 30.05,37.27 U102.11
  Bottom 0.254: U101.11 37.51,35.77 36.01,37.27 U102.11
ATMEGA_IO13*
  Top 0.203: R8.2 U1.D13 27.7,50.8 26.69,51.82 26.69,54.1 26.18,54.61 25.45,54.61 R7.2
  Bottom 0.203: U1.D13 27.96,37.85 30.13,35.67 U102.9
  Bottom 0.254: U101.9 36.85,34.77 35.95,35.67 U102.9
AVCC  (via drill 0.38)
  Route3 0.254: v49.55,37.59 49.55,35.81 42.69,28.96 v33.04,28.96
  Bottom 0.178: L100.2 30.47,30.56 C104.1
  Bottom 0.203: U102.24 48.43,36.47 v49.55,37.59 | U101.44 38.25,30 36.91,28.66 U102.44
  Bottom 0.254: L100.2 31.64,30.35 v33.04,28.96 33.04,28.94 34.42,27.56 36.83,27.56 U102.44 | U101.24 44.8,35.27 46,36.47 U102.24
AVRUSB_N  (via drill 0.38)
  Top 0.178: 8.14,47.75 v8.13,47.75 8.13,49.04 7.89,49.28 6.64,49.28 R1.2
  Bottom 0.178: v8.13,47.75 8.14,47.26 8.14,33.53 8.78,32.89 12.64,29.03 25.49,29.03 28.23,31.77 32.24,31.77 32.64,31.37 33.15,30.86 35.1,30.86 U102.3
  Bottom 0.254: U101.3 36.85,31.77 35.95,30.87 U102.3
AVRUSB_P  (via drill 0.38)
  Top 0.178: v9.16,39.12 6.64,39.12 R22.2
  Bottom 0.178: v9.16,39.12 9.03,38.99 9.03,33.15 12.79,29.39 25.34,29.39 28.23,32.27 32.24,32.27 32.89,31.62 35.06,31.62 U102.4
  Bottom 0.254: U102.4 35.99,31.67 36.59,32.27 U101.4
BC3  (via drill 0.38)
  Top 0.203: IC1.54 15.49,16.77 v15.75,16.51 | v19.15,6.15 19.1,6.15 18.54,5.59 17.78,5.59 17.02,4.83 17.02,2.54 17.53,2.03 R30.1
  Route3 0.203: v15.75,16.51 16.51,15.75 16.51,8.79 v19.15,6.15
BC4  (via drill 0.38)
  Top 0.203: IC1.55 14.99,18.55 v15.24,18.8 | R29.1 18.34,4.88 18.54,5.08 19.2,5.08 19.71,5.59 20.07,5.59 v20.32,5.84
  Route3 0.203: v20.32,5.84 20.32,6.6 17.27,9.65 17.27,16.76 v15.24,18.8
BD0_TXD/MPSSE_TCK  (via drill 0.38)
  Top 0.203: 18.32,10.81 v18.3,10.79
  Top 0.254: IC1.38 18.32,10.81
  Top 0.305: S1.46 57.49,17.2 v57.17,17.53
  Bottom 0.203: v18.3,10.79 22.11,14.61 44.09,14.61 48.78,19.3 55.64,19.3 57.17,17.78 v57.17,17.53
BD1_RXD/MPSSE_TDI
  Top 0.203: IC1.39 24.79,11.31 25.92,12.45 25.92,37.85 29.23,41.15 47.26,41.15 48.53,39.88 53.61,39.88 54.49,39 S1.141
BD2_MPSSE_TDO
  Top 0.203: IC1.40 24.53,11.81 25.42,12.7 25.42,38.1 28.97,41.66 47.51,41.66 48.78,40.39 53.74,40.39 54.99,39.13 S1.140
BD3_MPSSE_TMS
  Top 0.203: S1.138 55.99,38.77 53.86,40.89 49.04,40.89 47.77,42.16 28.72,42.16 24.91,38.35 24.91,12.95 24.27,12.31 IC1.41
BD4-DTR
  Top 0.203: S1.137 56.49,38.91 53.99,41.4 49.29,41.4 48.02,42.67 28.46,42.67 24.4,38.61 24.4,21.08 22.11,18.8 22.11,14.99 20.44,13.31 IC1.43
D0
  Top 0.203: S1.14 39.68,28.67 37.83,30.51 SRAM.9
D1
  Top 0.203: S1.15 39.41,28.17 37.03,30.55 SRAM.10
D2
  Top 0.203: S1.16 38.9,27.67 38.88,27.69 36.32,27.69 34.63,29.38 SRAM.13
D3
  Top 0.203: S1.17 37.11,27.17 37.1,27.18 35.31,27.18 33.83,28.65 SRAM.14
D4
  Top 0.203: SRAM.31 33.83,22.64 36.36,25.17 S1.21
D5
  Top 0.203: SRAM.32 34.63,22.68 36.62,24.67 S1.22
D6
  Top 0.203: SRAM.35 37.03,22.54 38.66,24.17 S1.23
D7
  Top 0.203: SRAM.36 37.83,22.57 38.92,23.67 S1.24
D+
  Top 0.254: AVRUSB.P3 5.22,43.56 6.37,42.42 6.37,41.39 R22.1
D-
  Top 0.254: AVRUSB.P2 6.9,44.22 7.13,44.45 7.13,46.75 R1.1
EECLK
  Top 0.203: IC1.62 11.49,19.09 11.7,19.3 12.46,19.3 12.97,19.81 12.97,24.38 13.48,24.89 13.48,26.92 13.04,27.37 U3.4 12.43,28.96 R24.1
EECS
  Top 0.178: IC1.63 10.99,25.71 11.7,26.42
  Top 0.203: U3.5 11.7,26.42 11.45,26.42 11.19,26.67 R23.1
EEDATA
  Top 0.203: R25.2 14.49,27.9 U3.3 14.43,27.37 13.99,26.92 13.99,24.64 13.48,24.13 13.48,19.3 12.72,18.54 12.21,18.54 11.99,18.32 IC1.61
FB_1V2
  Top 0.203: U2.10 15.78,47.99 15,48.77 15,51.18 14.33,51.85 R5.1 14.33,52.67 14.37,52.7 15.26,52.7 15.38,52.83 15.38,53.43 R4.2
FB_3V3
  Top 0.203: U2.1 11.46,47.99 11.19,48.26 11.19,51.27 R2.1 11.45,52.36 11.45,52.7 10.77,53.38 R3.2
FLASH_CS
  Top 0.203: FLASH.1 74.18,17.27 73.93,17.02 71.14,17.02 69.87,18.29 68.34,18.29 65.55,21.08 59.96,21.08 57.93,19.05 53.86,19.05 53.36,18.54 53.36,17.27 53.49,17.14 S1.38
FLASH_SCK
  Top 0.203: S1.70 69.49,14.35 69.74,14.1 77.11,14.1 77.74,14.73 FLASH.6
FLASH_SI  (via drill 0.38)
  Top 0.203: v79.52,13.46 FLASH.5 | S1.64 66.49,18.11 v66.94,18.54
  Bottom 0.203: v79.52,13.46 73.17,18.03 67.45,18.03 v66.94,18.54
FLASH_SO
  Top 0.203: S1.65 66.99,17.44 67.33,17.78 69.61,17.78 71.39,16 FLASH.2
FTUSB_N
  Top 0.178: IC1.7 2.44,12.81 1.21,14.04 1.21,25.33 2.12,26.24 9.22,26.24 10.08,27.1 10.08,32.59 9.49,33.19 FPGAUSB.D-
FTUSB_P
  Top 0.178: IC1.8 2.44,12.31 0.85,13.9 0.85,25.47 1.97,26.59 9.07,26.59 9.73,27.25 9.73,31.67 9.02,32.38 FPGAUSB.D+
GND  (via drill 0.38, 0.61, 0.61 pad 1.02)
  Top 0.203: 71.18,29.17 v71.14,29.21 | 52.3,29.17 v52.34,29.21 | 84.65,17.58 C26.2 | C32.2 59.97,9.16 | R3.1 12.37,53.17 v13.1,52.45 13.95,53.3 R4.1 13.99,53.63 13.99,54.1 14.49,54.61 16.53,54.61 17.03,54.1 17.03,52.32 17.32,52.04 PWR.C | v14.49,7.87 | C27.2 3.87,11.09 4.08,11.3 8.63,11.3 IC1.10 | C14.- 5.05,19.28 | 22.96,8.29 v22.88,8.38 | 23.85,15.46 v23.89,15.49 | 15.79,23.6 v15.76,23.62 | C22.2 45.95,19.77 | C11.2 77.99,33.78 | OSC.2@2 74.41,38.08 | LED.C U1.GND@2 | C36.2 69.1,12.19 | IC1.11 9.41,10.81 9.41,11.31 | C28.- 9.16,3.81 | C4.2 45.59,34.92 45.21,35.31 45.21,36.22 v44.92,36.51
  Top 0.254: v49.55,42.67 C5.2 | C21.2 v39.64,18.8 | U2.6 15.4,45.99 14.51,45.1 C3.1 | 13.75,45.99 U2.5 | IC1.47 20.92,15.31 21.1,15.49 v21.1,16.13 | IC1.25 v14.49,7.87 | IC1.13 9.45,9.81 9.67,9.6 9.67,9.02 9.47,8.81 IC1.15 7.82,8.81 v7.13,8.13 | IC1.51 16.99,18.33 v16.53,18.8 | IC1.10 9.41,11.31 10.31,11.31 v11.19,12.19 11.19,12.95 10.33,13.81 IC1.5 | R27.1 2.99,14.1 v2.5,14.58 | C30.2 22.96,8.29 | IC1.35 20.67,9.31 v21.35,8.64 | C31.2 23.6,9.11 v22.88,8.38 | C20.2 23.85,15.46 | SW2.B 28.11,12.8 v28.46,12.45 | SW2.B' 34.91,12.54 v34.81,12.45 | 59.97,9.16 59.97,8.9 59.96,8.64 v60.72,7.87 | C33.2 62.28,9.11 v63.52,7.87 | C29.2 11.45,2.71 v11.45,2.79 10.79,2.79 C28.- | C34.2 9.12,3.77 9.16,3.81
  Top 0.305: S1.113 68.49,36.09 v67.96,35.56 | 71.18,29.17 S1.96 | S1.91 71.14,26.67 v70.88,26.92 | S1.60 64.49,16.97 v64.66,17.14 | S1.13 52.3,29.17 | S1.136 56.99,35.89 v56.4,35.31 | C10.2 v45.74,26.16 | C23.2 v47.77,15.75 | C25.2 v80.92,19.56 | C13.2 v80.92,26.16 | C12.2 v80.92,27.81 | v51.32,12.7 C24.2 | FLASH.4 v77.49,13.46 | S1.54 61.49,16.77 v61.99,17.27 | S1.3 51.96,34.17 v52.34,34.54 | S1.68 68.49,16.36 v67.83,17.02 | S1.25 52.14,23.17 v52.59,23.62 | S1.77 71.92,19.67 71.64,19.68 70.88,20.45 v70.88,20.7 | S1.49 58.99,17.06 v59.2,17.27 | S1.130 59.99,36.6 59.96,36.32 58.94,35.31 v58.69,35.31 | AVRUSB.S4 4.21,41.15 | C8.2 C9.2 6.53,24.55 v5.86,23.88 | 5.05,19.28 v5.88,20.12 6.62,19.38 C15.2 | C16.2 10.05,22.17 v10.02,22.2 | IC1.1 8.64,16.52 v8.4,16.76 | C17.2 v11.95,20.32 | U3.2 16.02,26.42 v16.27,26.67 | C18.2 15.34,23.2 v15.76,23.62 | C19.- 15.79,23.6 | 45.95,19.77 v44.97,18.8 | 77.99,33.78 v77.99,35.05 | S1.73 71.25,17.67 v69.61,19.3 | C36.2 v71.14,12.19 | S1.108 73.54,35.17 v74.44,36.07 74.44,38.05 OSC.2@2 | v84.6,18.8 84.6,17.54 C26.2 | C35.2 63.77,44.07 v63.64,44.2
  Top 0.406: v57.42,42.93 C6.2 C7.2 | AVRUSB.P5 AVRUSB.S4 | SRAM.34 36.23,22.75 v36.34,22.86 | SRAM.12 35.43,33.28 34.98,33.73 v33.91,33.73
  Top 0.61: 14.51,45.1 13.75,45.99 13.75,49.8 C2.1 13.1,50.04 | 13.1,50.04 C1.1 | v13.1,52.45 13.1,50.04 | AVRUSB.S4 4.28,39.42 v4.59,39.12 | AVRUSB.S3 4.28,47.7 v4.59,48.01
  Route2 0.203: v28.46,12.45 28.72,12.45 | v34.81,12.45 34.56,12.45
  Bottom 0.203: Y1.2 36.85,46.33 C107.2 | 66,14.96 67.78,16.74 67.78,16.97 v67.83,17.02 | 39.12,32.77 39.12,33.39 v39.64,33.91 | U101.43 38.91,29.64 37.71,28.44 U102.43
  Bottom 0.254: 42.91,31.27 43.41,30.77 U101.33 44.2,30.76 44.2,30.23 45.15,29.27 U102.33 | 39.12,32.77 U101.5 36.33,32.77 36.07,32.51 35.15,32.51 U102.5 | 39.12,32.77 39.13,32.77 | U101.43 38.91,31.27 39.13,31.5 39.12,31.5 39.12,32.77 | U102.23 45.69,37.27 v44.92,36.51 | U101.15 39.91,37.43 39.31,38.03 U102.15 | U101.35 42.91,29.48 44.11,28.28 U102.35 | C102.1 34.19,26.4 v34.18,26.42 | C107.2 37.61,46.74 v37.73,46.86
  Bottom 0.279: 39.91,34.27 U101.15 | U101.35 42.91,31.27
  Bottom 0.305: U102.P$1 39.91,34.27 | 42.91,31.27 U102.P$1 | U101.23 43.56,35.77 43.3,35.51 43.15,35.51 U102.P$1 | v71.14,12.19 71.28,12.05
  other vias: 13.1,51.44 6.87,29.84 2.68,34.54 2.68,30.73 1.67,32.77 1.29,45.72 1.29,41.4 2.68,43.56 1.29,48.39 1.16,38.73 42.18,33.91 40.91,33.91 11.95,43.18 12.97,43.18
  pour Bottom (isolate 0.305, rank 3): 0,56 100,56 100,0 0,0
  pour Route2: 0,56 100,56 100,0 0,0
  pour Top: -0.75,36.83 9.41,36.83 9.41,27.94 -0.75,27.94
  pour Top: -1,49.53 5.35,49.53 5.35,38.1 -1,38.1
  pour Top (no thermals): 11.45,46.23 17.03,46.23 17.03,42.42 11.45,42.42
MEGA_D0
  Top 0.203: S1.116 66.99,39.54 67.33,39.88 67.33,41.15 69.1,42.93 69.1,48.26 68.09,49.28 66.82,49.28 65.84,50.25 R21.1 65.08,50.25
MEGA_D1
  Top 0.203: S1.117 66.49,39.67 66.82,40.01 66.82,41.4 68.22,42.8 R20.1
MEGA_D2
  Top 0.203: S1.118 65.99,39.81 66.31,40.13 66.31,41.66 66.69,42.04 R19.1
MEGA_D3
  Top 0.203: S1.119 65.49,39.95 65.8,40.26 65.8,47.28 R18.1
MEGA_D4
  Top 0.203: R17.1 52.38,54.61 53.1,54.61 53.61,54.1 53.61,49.53 56.66,46.48 63.26,46.48 65.29,44.45 65.29,40.39 64.99,40.08 S1.120
MEGA_D5
  Top 0.203: R16.1 51.07,53.38 51.07,49.28 52.59,47.75 54.63,47.75 56.4,45.97 63.01,45.97 64.79,44.2 64.79,40.51 64.49,40.22 S1.121
MEGA_D6
  Top 0.203: S1.123 63.49,39.22 62.75,40.01 62.75,44.2 61.48,45.47 56.15,45.47 54.37,47.24 49.29,47.24 48.53,48.01 48.53,54.1 48.02,54.61 47.3,54.61 R15.1
MEGA_D7
  Top 0.203: S1.124 62.99,39.1 62.25,39.88 62.25,43.94 61.23,44.96 55.9,44.96 54.12,46.74 47.77,46.74 45.99,48.51 45.99,54.1 45.48,54.61 44.76,54.61 R14.1
MEGA_D8
  Top 0.203: S1.126 61.99,39.49 61.74,39.75 61.74,43.69 60.98,44.45 55.64,44.45 53.86,46.23 42.94,46.23 42.18,46.99 42.18,53.85 41.42,54.61 40.69,54.61 R13.1
MEGA_D9
  Top 0.203: S1.127 61.49,39.37 61.23,39.62 61.23,43.43 60.72,43.94 55.39,43.94 53.61,45.72 40.66,45.72 39.39,46.99 39.39,54.36 39.13,54.61 38.15,54.61 R12.1
MEGA_D10
  Top 0.203: S1.131 59.49,39.08 53.36,45.21 37.57,45.21 37.57,45.25 36.85,45.97 36.85,54.36 36.59,54.61 35.61,54.61 R11.1
MEGA_D11
  Top 0.203: S1.132 58.99,38.95 53.23,44.7 35.32,44.7 34.31,45.72 34.31,54.36 34.05,54.61 33.07,54.61 R10.1
MEGA_D12
  Top 0.203: S1.133 58.49,38.81 53.1,44.2 33.29,44.2 31.77,45.72 31.77,54.36 31.51,54.61 30.53,54.61 R9.1
MEGA_D13
  Top 0.203: S1.134 57.99,38.67 52.98,43.69 32.78,43.69 29.23,47.24 29.23,54.1 28.72,54.61 27.99,54.61 R8.1
MEGA_D14
  Top 0.203: S1.115 67.49,39.41 67.83,39.75 67.83,40.89 69.61,42.67 69.61,48.77 U1.D14
  Bottom 0.203: U1.D14 65.29,48.51 57.17,48.51 54.63,45.97 54.63,34.8 51.5,31.67 U102.30
  Bottom 0.254: U101.30 45.2,32.27 45.8,31.67 U102.30
MEGA_D15
  Top 0.203: S1.114 67.99,39.27 68.34,39.62 68.34,40.64 70.12,42.42 U1.D15
  Bottom 0.203: U1.D15 67.33,48.01 57.42,48.01 55.13,45.72 55.13,34.54 51.46,30.87 U102.31
  Bottom 0.254: U101.31 44.93,31.77 45.83,30.87 U102.31
MEGA_D16
  Top 0.203: S1.112 68.99,38.47 68.85,38.61 68.85,40.39 70.63,42.16 70.63,48.77 U1.D16
  Bottom 0.203: U1.D16 69.36,47.5 57.67,47.5 55.64,45.47 55.64,34.29 51.43,30.07 U102.32
  Bottom 0.254: U101.32 44.67,31.27 45.85,30.1 46.69,30.1 U102.32
MEGA_D17
  Top 0.203: S1.111 69.49,38.73 69.36,38.86 69.36,40.13 71.14,41.91 71.14,48.51 71.9,49.28 73.68,49.28 U1.D17
MEGA_D18
  Top 0.203: S1.105 73.81,33.67 76.47,36.32 79.52,36.32 80.03,36.83 80.03,44.7 77.74,46.99 U1.D18
MEGA_D19
  Top 0.203: U1.D19 82.82,48.26 82.82,36.83 78.76,32.77 75.2,32.77 74.6,32.17 S1.102
MEGA_D20
  Top 0.203: U1.D20 83.33,50.29 83.33,36.58 79.01,32.26 75.45,32.26 74.86,31.67 S1.101
MEGA_D21
  Top 0.203: U1.D21 83.84,49.28 83.84,36.32 79.26,31.75 75.71,31.75 75.12,31.17 S1.100
MEGA_D22
  Top 0.203: U1.D22 92.73,48.26 91.71,47.24 89.68,47.24 88.41,45.97 88.41,44.96 86.38,42.93 86.38,38.1 79.52,31.24 75.96,31.24 75.39,30.67 S1.99
MEGA_D23
  Top 0.203: U1.D23 94.76,48.26 93.49,46.99 92.22,46.99 91.96,46.74 89.93,46.74 88.92,45.72 88.92,44.7 86.88,42.67 86.88,37.85 79.77,30.73 76.22,30.73 75.65,30.17 S1.98
MEGA_D24
  Top 0.203: U1.D24 92.22,45.72 91.2,44.7 89.68,44.7 87.39,42.42 87.39,37.59 80.03,30.23 76.47,30.23 75.91,29.67 S1.97
MEGA_D25
  Top 0.203: U1.D25 94.76,45.72 93.49,44.45 92.22,44.45 91.96,44.2 89.93,44.2 87.9,42.16 87.9,37.34 80.28,29.72 76.72,29.72 76.22,29.21 74.69,29.21 74.15,28.67 S1.95
MEGA_D26
  Top 0.203: U1.D26 91.96,43.18 90.95,42.16 89.42,42.16 88.41,41.15 88.41,37.08 80.53,29.21 76.98,29.21 76.47,28.7 74.95,28.7 73.91,27.67 S1.93
MEGA_D27
  Top 0.203: U1.D27 94.76,43.18 93.49,41.91 92.22,41.91 91.96,41.66 89.68,41.66 88.92,40.89 88.92,36.83 80.79,28.7 77.23,28.7 76.72,28.19 75.2,28.19 74.17,27.17 S1.92
MEGA_D28/A5  (via drill 0.38)
  Top 0.203: S1.88 76.2,25.17 77.49,25.15 81.3,25.15 82.31,26.16 82.31,29.21 90.95,37.85 90.95,38.86 92.73,40.64 U1.D28
  Top 0.254: S1.88 68.62,25.17 68.09,24.64 60.21,24.64 v57.17,27.69
  Bottom 0.254: U1.A5 62.5,11.43 63.77,12.7 63.77,21.59 57.93,27.69 v57.17,27.69 53.86,27.69 48.78,22.35 44.07,22.35 43.31,23.11 U102.36 43.31,28.32 42.41,29.22 U101.36
MEGA_D29
  Top 0.203: U1.D29 94.25,39.37 92.22,39.37 91.46,38.61 91.46,37.59 82.82,28.96 82.82,25.91 81.55,24.64 77.23,24.64 75.93,24.67 S1.87
MEGA_D30/A4  (via drill 0.38)
  Top 0.203: U1.D30 92.73,38.1 83.33,28.7 83.33,25.65 81.8,24.13 74.18,24.13 73.72,23.67 S1.85
  Top 0.254: v57.42,24.38 58.44,23.37 70.88,23.37 71.18,23.67 S1.85
  Bottom 0.254: U1.A4 61.74,4.32 61.74,11.43 63.26,12.95 63.26,21.08 59.96,24.38 v57.42,24.38 51.58,24.38 49.04,21.84 43.69,21.84 42.51,23.02 U102.37 42.51,28.36 41.91,28.96 U101.37
MEGA_D31
  Top 0.203: U1.D31 94.25,36.83 92.22,36.83 83.84,28.45 83.84,25.4 82.06,23.62 74.44,23.62 73.98,23.17 S1.84
MEGA_D32/A3  (via drill 0.38)
  Top 0.203: U1.D32 91.71,35.56 84.34,28.19 84.34,25.15 82.31,23.11 74.69,23.11 74.24,22.67 S1.83
  Top 0.254: S1.83 57.73,22.67 v57.67,22.61
  Bottom 0.254: U1.A3 57.42,5.84 61.23,9.65 61.23,11.68 62.75,13.21 62.75,19.3 59.45,22.61 v57.67,22.61 52.85,22.61 51.58,21.34 42.18,21.34 41.71,21.81 U102.38 41.71,28.27 41.41,28.57 U101.38
MEGA_D33
  Top 0.203: U1.D33 94.25,34.29 91.2,34.29 84.85,27.94 84.85,24.89 82.57,22.61 74.95,22.61 74.51,22.17 S1.82
MEGA_D34/A2  (via drill 0.38)
  Top 0.203: U1.D34 90.69,33.02 85.36,27.69 85.36,24.64 82.82,22.1 75.2,22.1 74.77,21.67 S1.81
  Top 0.254: S1.81 59.27,21.67 v58.44,20.83
  Bottom 0.254: U1.A2 54.88,5.08 56.15,6.35 57.17,6.35 60.72,9.91 60.72,18.54 v58.44,20.83 41.93,20.83 40.91,21.84 U102.39 U101.39
MEGA_D35
  Top 0.203: U1.D35 94.25,31.75 90.19,31.75 85.87,27.43 85.87,24.38 83.07,21.59 75.45,21.59 75.03,21.17 S1.80
MEGA_D36
  Top 0.203: U1.D36 89.68,30.48 86.38,27.18 86.38,24.13 83.33,21.08 75.71,21.08 75.29,20.67 S1.79
MEGA_D37
  Top 0.203: U1.D37 94.25,29.21 89.17,29.21 86.88,26.92 86.88,23.88 83.58,20.57 75.96,20.57 75.55,20.17 S1.78
MEGA_D38
  Top 0.203: S1.75 74.31,18.67 74.56,18.67 82.44,18.67 87.39,23.62 87.39,25.4 88.92,26.92 91.96,26.92 U1.D38
MEGA_D39
  Top 0.203: S1.74 74.05,18.17 74.31,18.16 82.69,18.16 87.9,23.37 87.9,25.15 89.17,26.42 92.22,26.42 92.47,26.67 94.25,26.67 U1.D39
MEGA_D40
  Top 0.203: U1.D40 92.98,24.89 92.73,24.64 91.71,24.64 91.46,24.38 89.68,24.38 87.9,22.61 87.9,17.02 83.58,12.7 73.17,12.7 72.28,13.59 68.72,13.59 67.99,14.32 S1.67
MEGA_D41
  Top 0.203: S1.66 67.49,14.06 68.47,13.08 72.03,13.08 72.91,12.19 83.84,12.19 88.41,16.76 88.41,22.35 89.93,23.88 91.71,23.88 91.96,24.13 94.25,24.13 U1.D41
MEGA_D42
  Top 0.203: S1.62 65.49,12.25 66.31,11.43 71.64,11.43 71.9,11.68 84.09,11.68 88.92,16.51 88.92,20.57 89.93,21.59 91.2,21.59 92.47,22.86 U1.D42
MEGA_D43
  Top 0.203: S1.61 64.99,12.12 66.18,10.92 71.9,10.92 72.15,11.18 84.34,11.18 89.42,16.26 89.42,17.53 91.71,19.81 91.71,21.08 92.22,21.59 94.25,21.59 U1.D43
MEGA_D44
  Top 0.203: U1.D44 89.93,17.27 89.93,16 84.6,10.67 72.41,10.67 72.15,10.41 66.06,10.41 63.99,12.48 S1.59
MEGA_D45
  Top 0.203: U1.D45 94.76,20.32 93.49,19.05 92.47,19.05 90.44,17.02 90.44,15.75 84.85,10.16 72.66,10.16 72.41,9.91 65.93,9.91 63.49,12.35 S1.58
MEGA_D46
  Top 0.203: U1.D46 92.22,17.78 90.95,16.51 90.95,15.49 85.11,9.65 72.91,9.65 72.66,9.4 65.8,9.4 62.99,12.21 S1.57
MEGA_D47
  Top 0.203: U1.D47 94.76,17.78 93.49,16.51 92.22,16.51 91.46,15.75 91.46,15.24 85.36,9.14 73.17,9.14 72.91,8.89 65.67,8.89 62.49,12.08 S1.56
MEGA_D48
  Top 0.203: U1.D48 92.22,15.24 83.33,6.35 69.36,6.35 67.33,8.38 65.55,8.38 61.99,11.94 S1.55
MEGA_D49
  Top 0.203: U1.D49 94.76,15.24 93.49,13.97 91.71,13.97 83.58,5.84 69.1,5.84 68.09,6.86 60.21,6.86 58.94,8.13 58.94,11.94 59.99,12.98 S1.51
MEGA_D50
  Top 0.203: U1.D50 91.2,12.7 83.84,5.33 68.85,5.33 67.83,6.35 59.96,6.35 58.44,7.87 58.44,12.19 59.49,13.24 S1.50
MEGA_D51
  Top 0.203: U1.D51 94.76,12.7 93.49,11.43 90.69,11.43 84.09,4.83 68.6,4.83 67.58,5.84 59.71,5.84 57.93,7.62 57.93,12.45 58.49,13.01 S1.48
MEGA_D52
  Top 0.203: U1.D52 90.19,10.16 84.34,4.32 68.34,4.32 67.33,5.33 59.45,5.33 57.42,7.37 57.42,12.7 57.99,13.27 S1.47
MEGA_D53  (via drill 0.38)
  Top 0.203: v51.07,9.65 R32.1 52.59,9.61 52.59,8.89 56.66,4.83 66.56,4.83 67.07,4.32 67.07,4.3 67.56,3.81 85.34,3.81 90.42,8.89 94.25,8.89 U1.D53
  Top 0.305: S1.39 53.99,17.4 v54.63,18.03
  Bottom 0.203: v54.63,18.03 52.09,18.03 50.31,16.26 50.31,10.41 v51.07,9.65
N$1
  Bottom 0.254: U102.22 44.91,38.05 U101.22
N$2
  Top 0.203: LED.A 24.56,42.26 24.15,42.67 24.15,51.78 R7.1
N$8
  Top 0.203: PWR.A 20.09,54.14 R6.1
N$9
  Top 0.203: IC1.6 6.35,13.31 R27.2
N$22
  Top 0.178: C9.1 8.23,22.69 X1.1
  Top 0.203: IC1.2 9.49,15.31 9.67,15.49 9.67,17.78 8.4,19.05 8.4,22.35 X1.1
N$23
  Top 0.178: C8.1 3.1,22.64 X1.2
  Top 0.203: IC1.3 7.81,14.81 7.64,14.99 7.64,19.56 6.11,21.08 4.59,21.08 X1.2
N$24
  Top 0.305: R30.2 RX.C
N$25
  Top 0.305: R29.2 TX.C
N$45
  Top 0.203: R25.1 R26.1 17.07,31.08 17.29,30.86 17.29,26.42 16.4,25.53 15.09,25.53 U3.1
N$48
  Top 0.203: L3.1 3.81,16.93 C14.+ 5.11,16.93 C15.1 6.37,16.68 6.37,14.73 6.78,14.31 IC1.4
N$49
  Top 0.203: IC1.9 3.07,11.81 2.43,11.18 2.43,7.37 3.83,5.97 L4.1
  Top 0.254: C34.1 7.42,3.16 C28.+ 6.15,4.43 L4.1
NC
  Bottom 0.203: U101.1 37.63,30.02 36.89,29.27 U102.1
  Bottom 0.254: 35.17,29.21 U102.1
OSC_IN
  Top 0.203: OSC.3@3 77.64,38.2 76.22,39.62 72.91,39.62 71.39,38.1 71.39,36.32 70.88,35.81 69.61,35.81 68.6,34.8 68.6,30.23 70.66,28.17 S1.94
RESET  (via drill 0.38)
  Top 0.203: SW2.A 28.08,9.91 26.18,9.91 25.16,8.89 25.16,6.1 26.04,5.22 R31.1 26.92,5.21 26.92,2.79 28.7,1.02 32.26,1.02 33.27,2.03 33.27,4.32 v34.91,5.96 SW2.A'
  Top 0.305: S1.37 52.16,15.32 v52.09,15.24
  Bottom 0.203: v52.09,15.24 58.18,15.24 58.69,14.73 58.69,10.16 56.4,7.87 51.32,7.87 49.29,5.84 35.03,5.84 v34.91,5.96
SW1
  Top 0.203: S1.104 74.08,33.17 76.72,35.81 79.77,35.81 80.53,36.58 80.53,40.39 SW1.COM2
SW_1V2
  Top 0.254: U2.8 19.15,46.99 L2.1
SW_3V3
  Top 0.254: U2.4 11.33,46.49 11.19,46.35 11.19,44.2 10.43,43.43 9.24,43.43 L1.1
UCAP
  Bottom 0.254: U101.6 U102.6 34.54,33.27 34.04,32.77 32.61,32.77 C103.1
XTAL1
  Bottom 0.203: C107.1 34.7,44.89 Y1.1 | 34.81,46.85 C107.1 | 34.56,46.48 34.56,46.88 C107.1 | U102.17 40.91,43.69 39.39,45.21 39.01,45.21 R109.1 38.88,47.99 38.23,48.64 35.43,48.64 34.8,48.01 34.8,46.83 C107.1
  Bottom 0.254: U101.17 U102.17
XTAL2
  Bottom 0.203: C106.2 36.45,42.49 Y1.3 36.85,43.19 37.35,43.69 38.75,43.69 R109.2 39.01,43.69 39.89,43.69 40.41,43.17 40.41,40.54 40.11,40.24 U102.16
  Bottom 0.254: U101.16 40.41,38.08 40.11,38.38 U102.16
  Bottom 0.305: Y1.3 36.72,42.89

## Text on the board
tNames: GND
tDocu: Top silkscreen is on layer 130: tSilk | Bottom silkscreen is on layer 200
tSilk: AVR USB | AL | BL | AVR | GND | 5V | FPGA USB | FPGA | CL | JTAG | C | DH | D | 2/11/2015 | CH | DL | FPGA Reset | Papilio Platform | Papilio Duo | www.GadgetFactory.net | www.Papilio.cc | 2MB | BPC3013 V1.7 | 512KB | CC-BY-SA 4.0 | Copyright 2014 | Gadget Factory, LLC
200bmp: To get started visit: Duo.GadgetFactory.net